# Altium schematic sheet IoT_Greenhouse V1.0 A - Esp32.SchDoc
size A3; DrawnBy: Elio F; Engineer: Elio F; Revision: A; SheetNumber: 3; SheetTotal: 5; Sheet Title: ESP32-C6
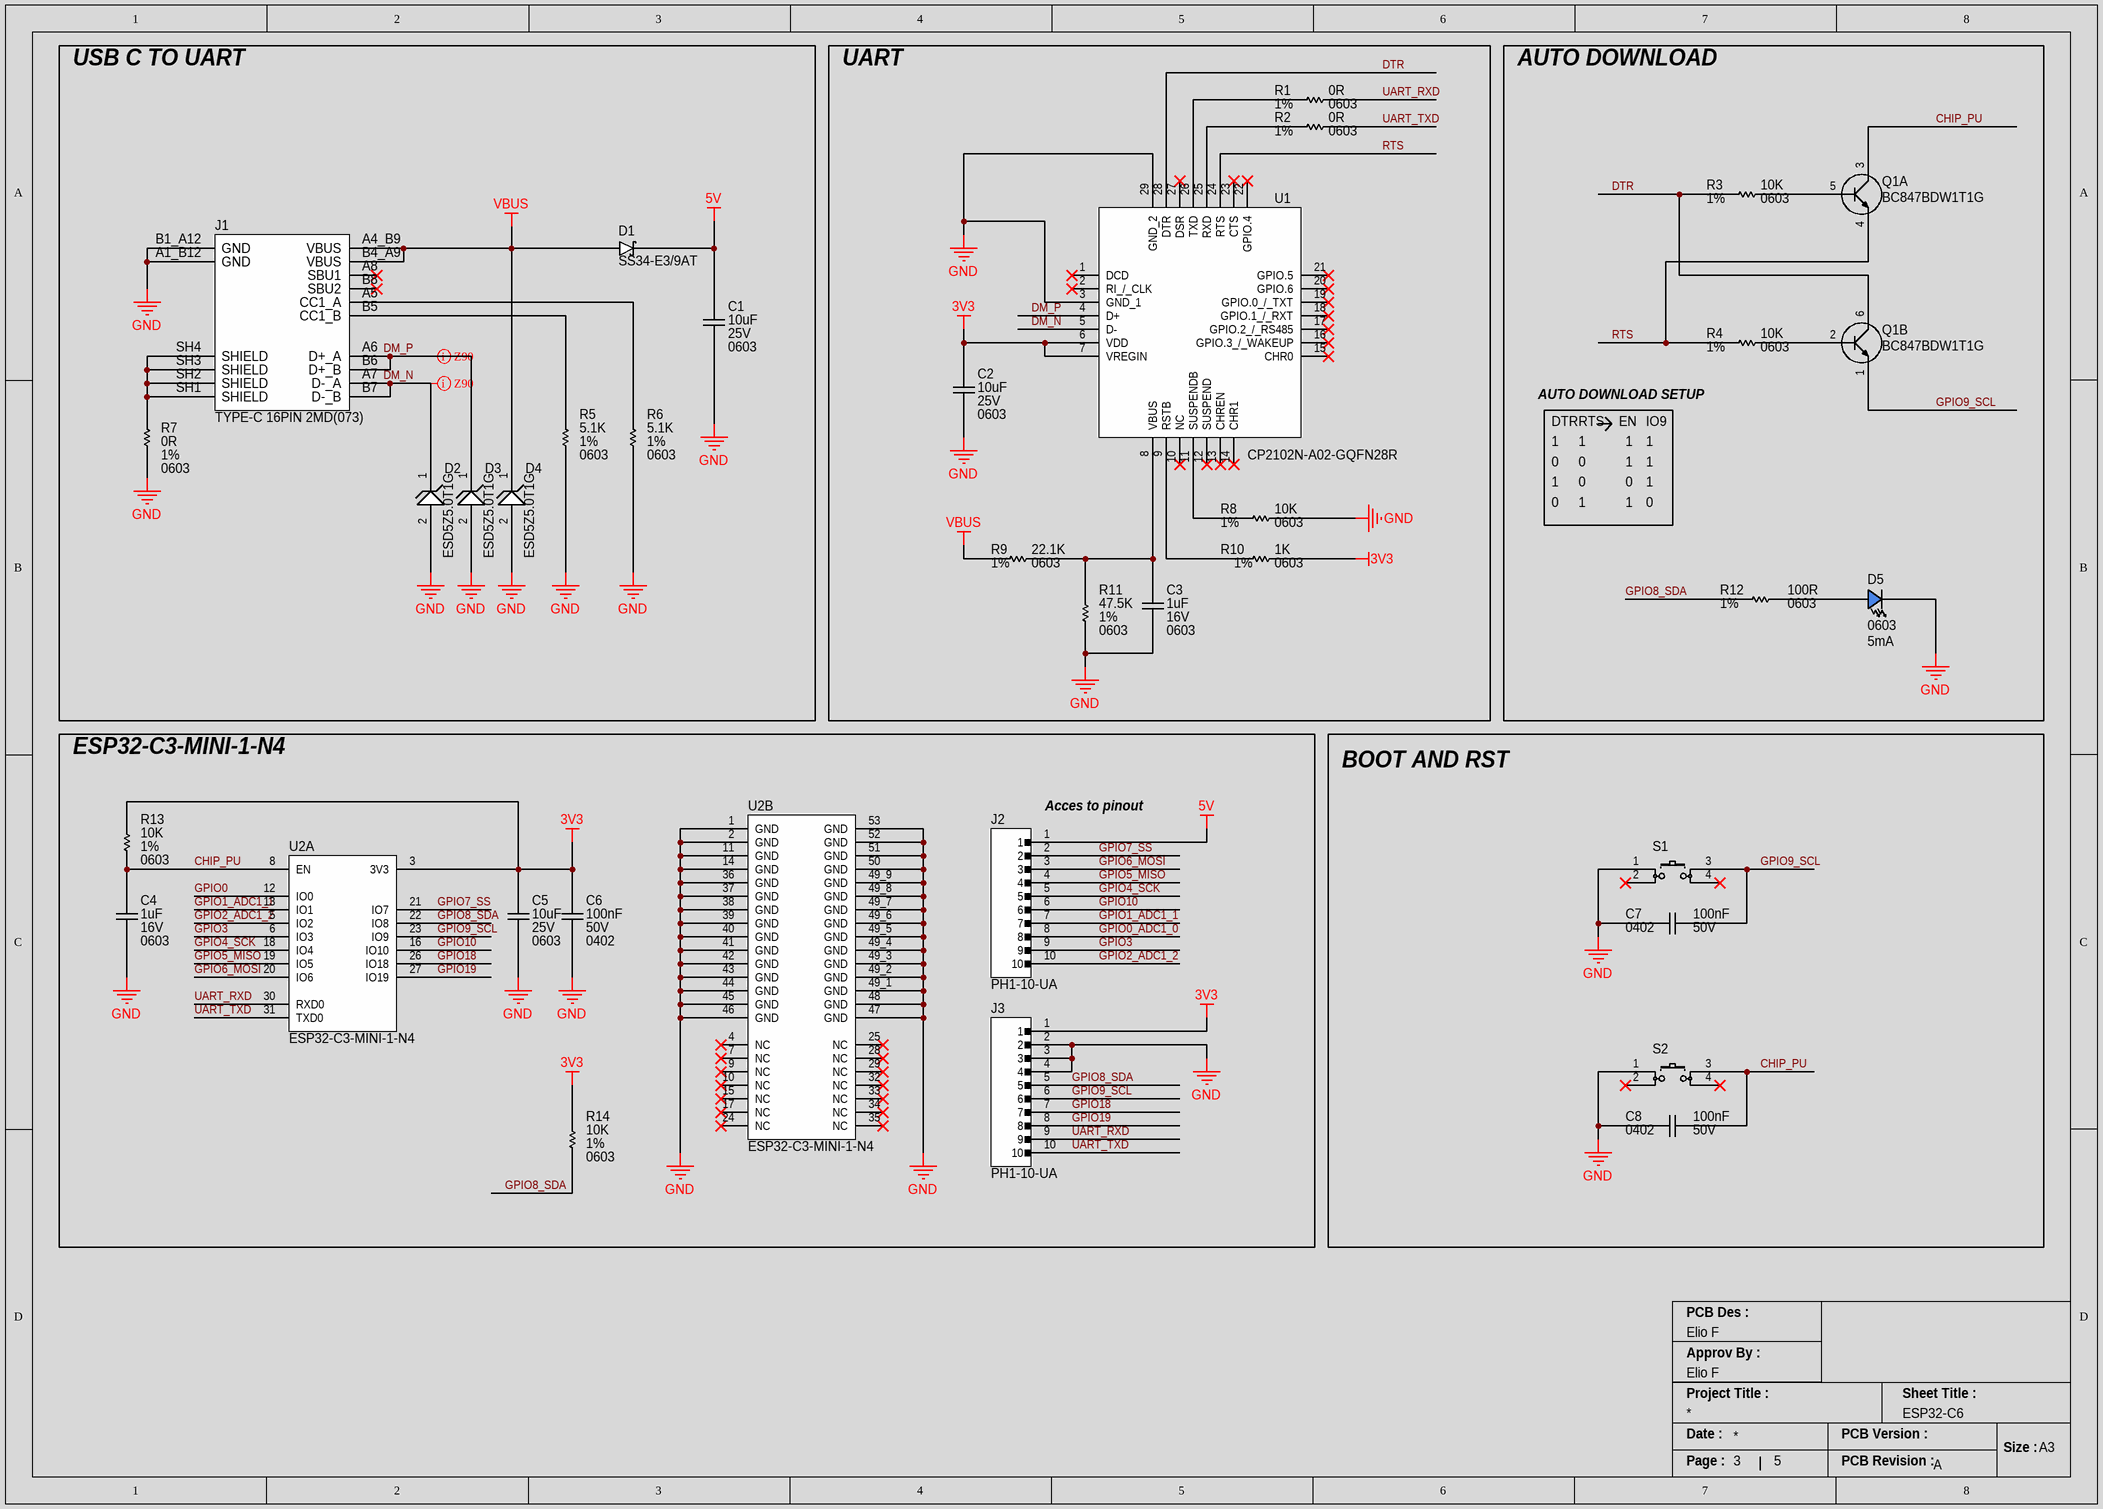
[diagram p0: IoT_Greenhouse V1.0 A - Esp32.SchDoc]

## Parts
C1  Case/Package: 0603  Capacitance: 10uF  Voltage Rating: 25V  [CAP_0603_CAPC1608X08N]  (hidden comment: GRM188R61E106MA73D)
C2  Case/Package: 0603  Capacitance: 10uF  Voltage Rating: 25V  [CAP_0603_CAPC1608X08N]  (hidden comment: GRM188R61E106MA73D)
C3  Voltage Rating: 16V  Capacitance: 1uF  Case/Package: 0603  [CAP_0603_CAPC1608X08N]  (hidden comment: CL10A105KO8NNNC)
C4  Voltage Rating: 16V  Capacitance: 1uF  Case/Package: 0603  [CAP_0603_CAPC1608X08N]  (hidden comment: CL10A105KO8NNNC)
C5  Case/Package: 0603  Capacitance: 10uF  Voltage Rating: 25V  [CAP_0603_CAPC1608X08N]  (hidden comment: GRM188R61E106MA73D)
C6  Voltage Rating: 50V  Capacitance: 100nF  Case/Package: 0402  [CAP_0402_CAPC1005X05N]  (hidden comment: GRM155R71H104KE14D)
C7  Voltage Rating: 50V  Capacitance: 100nF  Case/Package: 0402  [CAP_0402_CAPC1005X05N]  (hidden comment: GRM155R71H104KE14D)
C8  Voltage Rating: 50V  Capacitance: 100nF  Case/Package: 0402  [CAP_0402_CAPC1005X05N]  (hidden comment: GRM155R71H104KE14D)
D1  SS34-E3/9AT  [DIO_Vishay_SMC_MFG]
D2  ESD5Z5.0T1G  [SOD523_SODFL1608X70N]
D3  ESD5Z5.0T1G  [SOD523_SODFL1608X70N]
D4  ESD5Z5.0T1G  [SOD523_SODFL1608X70N]
D5  Case Code (Imperial): 0603  Test Current: 5mA  [LED_0603-BLUE-0.75mm]  (hidden comment: LTST-C193TBKT-5A)
J1  TYPE-C 16PIN 2MD(073)  [CONN_USB_C_16P]
J2  PH1-10-UA  [CONN_HEADER_MALE_10P]
J3  PH1-10-UA  [CONN_HEADER_MALE_10P]
Q1  BC847BDW1T1G  [TRANS_BJT_SOT65P210X110-6N]  (parts A,B of 2)
R1  Tolerance: 1%  Resistance: 0R  Case Code (Imperial): 0603  [RES_0603_RESC1608X04N]  (hidden comment: RC0603FR-070RL)
R2  Tolerance: 1%  Resistance: 0R  Case Code (Imperial): 0603  [RES_0603_RESC1608X04N]  (hidden comment: RC0603FR-070RL)
R3  Resistance: 10K  Tolerance: 1%  Case/Package: 0603  [RES_0603_RESC1608X04N]  (hidden comment: AC0603FR-1010KL)
R4  Resistance: 10K  Tolerance: 1%  Case/Package: 0603  [RES_0603_RESC1608X04N]  (hidden comment: AC0603FR-1010KL)
R5  Tolerance: 1%  Resistance: 5.1K  Case/Package: 0603  [RES_0603_RESC1608X04N]  (hidden comment: RC0603FR-075K1L)
R6  Tolerance: 1%  Resistance: 5.1K  Case/Package: 0603  [RES_0603_RESC1608X04N]  (hidden comment: RC0603FR-075K1L)
R7  Tolerance: 1%  Resistance: 0R  Case Code (Imperial): 0603  [RES_0603_RESC1608X04N]  (hidden comment: RC0603FR-070RL)
R8  Resistance: 10K  Tolerance: 1%  Case/Package: 0603  [RES_0603_RESC1608X04N]  (hidden comment: AC0603FR-1010KL)
R9  Resistance: 22.1K  Tolerance: 1%  Case/Package: 0603  [RES_0603_RESC1608X04N]  (hidden comment: RC0603FR-0722K1L)
R10  Resistance: 1K  Tolerance: 1%  Case/Package: 0603  [RES_0603_RESC1608X04N]  (hidden comment: AC0603FR-101KL)
R11  Tolerance: 1%  Resistance: 47.5K  Case/Package: 0603  [RES_0603_RESC1608X04N]  (hidden comment: AC0603FR-0747K5L)
R12  Case Code (Imperial): 0603  Tolerance: 1%  Resistance: 100R  [CAP_0603_CAPC1608X08N]  (hidden comment: ERJ3EKF1000V)
R13  Resistance: 10K  Tolerance: 1%  Case/Package: 0603  [RES_0603_RESC1608X04N]  (hidden comment: AC0603FR-1010KL)
R14  Resistance: 10K  Tolerance: 1%  Case/Package: 0603  [RES_0603_RESC1608X04N]  (hidden comment: AC0603FR-1010KL)
S1  PTS526SK15SMTR2LFS  [SWT_NO_PTS526SK15SMTR2LFS]  (value not drawn)
S2  PTS526SK15SMTR2LFS  [SWT_NO_PTS526SK15SMTR2LFS]  (value not drawn)
U1  CP2102N-A02-GQFN28R  [IC_BRIDGE_UART_QFN50P500X500X80-29N-D]
U2  ESP32-C3-MINI-1-N4  [XCVR_ESP32-C3-MINI-1-N4]  (parts A,B of 2)

## Blocks framed on the sheet
USB C TO UART: C1 D1-D4 J1 R5-R7
UART: C2 C3 R1 R2 R8-R11 U1
AUTO DOWNLOAD: D5 Q1 R3 R4 R12
ESP32-C3-MINI-1-N4: C4-C6 J2 J3 R13 R14 U2
BOOT AND RST: C7 C8 S1 S2

## Nets
3V3: C2.2 C5.2 C6.2 J3.1 R10.2 R13.1 R14.1 U1.6(VDD) U1.7(VREGIN) U2.3(3V3)
5V: C1.2 D1.1(K) J2.1
GND: C1.1 C2.1 C3.1 C4.1 C5.1 C6.1 C7.2 C8.2 D2.2(A) D3.2(A) D4.2(A) D5.1(C) J1.A1_B12(GND) J1.B1_A12(GND) J3.2 J3.3 J3.4 R5.1 R6.1 R7.1 R8.2 R11.1 S1.1(COM_1) S2.1(COM_1) U1.3(GND_1) U1.29(GND_2) U2.1(GND) U2.2(GND) U2.11(GND) U2.14(GND) U2.36(GND) U2.37(GND) U2.38(GND) U2.39(GND) U2.40(GND) U2.41(GND) U2.42(GND) U2.43(GND) U2.44(GND) U2.45(GND) U2.46(GND) U2.47(GND) U2.48(GND) U2.49_1(GND) U2.49_2(GND) U2.49_3(GND) U2.49_4(GND) U2.49_5(GND) U2.49_6(GND) U2.49_7(GND) U2.49_8(GND) U2.49_9(GND) U2.50(GND) U2.51(GND) U2.52(GND) U2.53(GND)
VBUS: D1.2(A) D4.1(K) J1.A4_B9(VBUS) J1.B4_A9(VBUS) R9.1
CHIP_PU: C4.2 C8.1 Q1.3(COLLECTOR_1) R13.2 S2.3(NO1) U2.8(EN)
DM_N: D2.1(K) J1.A7(D-_A) J1.B7(D-_B) U1.5(D-)
DM_P: D3.1(K) J1.A6(D+_A) J1.B6(D+_B) U1.4(D+)
DTR: Q1.6(COLLECTOR_2) R3.2 U1.28(DTR)
GPIO0: U2.12(IO0)
GPIO0_ADC1_0: J2.8
GPIO1_ADC1_1: J2.7 U2.13(IO1)
GPIO2_ADC1_2: J2.10 U2.5(IO2)
GPIO3: J2.9 U2.6(IO3)
GPIO4_SCK: J2.5 U2.18(IO4)
GPIO5_MISO: J2.4 U2.19(IO5)
GPIO6_MOSI: J2.3 U2.20(IO6)
GPIO7_SS: J2.2 U2.21(IO7)
GPIO8_SDA: J3.5 R12.1 R14.2 U2.22(IO8)
GPIO9_SCL: C7.1 J3.6 Q1.1(EMITTER_2) S1.3(NO1) U2.23(IO9)
GPIO10: J2.6 U2.16(IO10)
GPIO18: J3.7 U2.26(IO18)
GPIO19: J3.8 U2.27(IO19)
RTS: Q1.4(EMITTER_1) R4.2 U1.24(RTS)
UART_RXD: J3.9 R1.1 U2.30(RXD0)
UART_TXD: J3.10 R2.1 U2.31(TXD0)
NetC3_2: C3.2 R9.2 R11.2 U1.8(VBUS)
NetD5_2: D5.2(A) R12.2
NetJ1_A5: J1.A5(CC1_A) R6.2
NetJ1_B5: J1.B5(CC1_B) R5.2
NetJ1_SH1: J1.SH1(SHIELD) J1.SH2(SHIELD) J1.SH3(SHIELD) J1.SH4(SHIELD) R7.2
NetQ1_2: Q1.2(BASE_2) R4.1
NetQ1_5: Q1.5(BASE_1) R3.1
NetR1_2: R1.2 U1.26(TXD)
NetR2_2: R2.2 U1.25(RXD)
NetR8_1: R8.1 U1.11(SUSPENDB)
NetR10_1: R10.1 U1.9(RSTB)

Not connected (* = marked no-connect by the designer): J1 A8(SBU1)* B8(SBU2)*; S1 2(COM2)* 4(NO2)*; S2 2(COM2)* 4(NO2)*; U1 1(DCD)* 2(RI_/_CLK)* 10(NC)* 12(SUSPEND)* 13(CHREN)* 14(CHR1)* 15(CHR0)* 16(GPIO.3_/_WAKEUP)* 17(GPIO.2_/_RS485)* 18(GPIO.1_/_RXT)* 19(GPIO.0_/_TXT)* 20(GPIO.6)* 21(GPIO.5)* 22(GPIO.4)* 23(CTS)* 27(DSR)*; U2 4(NC)* 7(NC)* 9(NC)* 10(NC)* 15(NC)* 17(NC)* 24(NC)* 25(NC)* 28(NC)* 29(NC)* 32(NC)* 33(NC)* 34(NC)* 35(NC)*

## Layout directives
differential pair; differential pair class Z90; net class Z90: DM_N, DM_P

## Notes on the sheet
- AUTO DOWNLOAD SETUP
- DTR
- 1
- RTS
- EN
- IO9
- 0
- (near J2) Acces to pinout
- PCB Des :
- Approv By :
- Project Title :
- Sheet Title :
- Date :
- PCB Version :
- Size :
- A3
- Page :
- PCB Revision :

## Library data of the parts
C1 C2 C5 = CAP_10UF_25V_X5R_0603: Multilayer Ceramic Capacitor, 10 uF, 25 V, ± 20%, X5R, 0603 [1608 Metric]; Manufacturer: Murata; Material: 4241ConductorMaterial; Supplier 1: Digi-Key; Manufacturer Part Number: GRM188R61E106MA73D; RoHS: Yes; Category: Ceramic Capacitors; Stock 1: 2712970; Pricing 1: 1=0.26, 10=0.168, 50=0.1176, 100=0.0949, 500=0.07054, 1000=0.06173 (USD); Mount: Surface Mount; Number of Pins: 2; Case Code (Imperial): 0603; Weight: 0.000222oz; Min Operating Temperature: -55°C; Max Operating Temperature: 85°C; Tolerance: 20%; Packaging: Cut Tape; Package Quantity: 1; Dielectric: X5R; Voltage: 25V; Termination: SMD/SMT; Voltage Rating (DC): 25V; Series: GRM; Construction: Flat; Length: 1.6mm; Width: 0.031inch; Height: 0.8mm; Thickness: 0.031inch; Depth: 0.8mm; Reach SVHC Compliant: No; Lead Free: Lead Free; RoHS Compliant: Yes; ComponentLink1URL: https://datasheet.ciiva.com/22776/c02e-22776427.pdf?src-supplier=Farnell; ComponentLink1Description: https://datasheet.ciiva.com/22776/c02e-22776427.pdf?src-supplier=Farnell; ComponentLink2URL: https://datasheet.ciiva.com/22619/c02e-22619674.pdf?src-supplier=Element14; ComponentLink2Description: https://datasheet.ciiva.com/22619/c02e-22619674.pdf?src-supplier=Element14; ComponentLink3URL: https://datasheet.ciiva.com/22776/608985-22776426.pdf?src-supplier=Farnell; ComponentLink3Description: https://datasheet.ciiva.com/22776/608985-22776426.pdf?src-supplier=Farnell; ComponentLink4URL: https://datasheet.ciiva.com/14906/partnumbering-e-01-14906431.pdf?src-supplier=Digi-Key; ComponentLink4Description: https://datasheet.ciiva.com/14906/partnumbering-e-01-14906431.pdf?src-supplier=Digi-Key; ComponentLink5URL: https://datasheet.ciiva.com/14906/partnumbering-e-01-14906429.pdf?src-supplier=Digi-Key; ComponentLink5Description: https://datasheet.ciiva.com/14906/partnumbering-e-01-14906429.pdf?src-supplier=Digi-Key; Supplier Part Number 1: 490-7202-1-ND; Case Code (Metric): 1608
C3 C4 = CAP_1UF_16V_X5R_0603: CAP CER 1UF 16V X5R 0603; Manufacturer: Samsung; Material: Ceramic; Tolerance: 10%; Manufacturer Part Number: CL10A105KO8NNNC; RoHS: Yes; Category: Ceramic Capacitors; Stock 1: 252255; Pricing 1: 1=0.10000, 10=0.03300, 50=0.01800, 100=0.01470, 500=0.01050, 1000=0.00825 (USD); Mount: Surface Mount; Case Code (Metric): 1608; Case Code (Imperial): 0603; Contact Plating: Tin; Min Operating Temperature: -55°C; Max Operating Temperature: 85°C; Package Quantity: 1; Packaging: Tape and Reel; Dielectric: X5R; Voltage Rating (DC): 16V; Series: CL; Voltage: 16V; Construction: Flat; Length: 1.6mm; Width: 0.031inch; Height: 0.8mm; Thickness: 0.035inch; Depth: 0.8mm; Radiation Hardening: No; Lead Free: Lead Free; RoHS Compliant: Yes; ComponentLink1URL: https://datasheet.ciiva.com/16199/cl10a105ko8nnnc-16199033.pdf?src-supplier=Future+Electronics; ComponentLink1Description: https://datasheet.ciiva.com/16199/cl10a105ko8nnnc-16199033.pdf?src-supplier=Future+Electronics; ComponentLink2URL: https://datasheet.ciiva.com/15195/getdatasheetpartid-359688-15195706.pdf?src-supplier=Verical; ComponentLink2Description: https://datasheet.ciiva.com/15195/getdatasheetpartid-359688-15195706.pdf?src-supplier=Verical; ComponentLink3URL: https://datasheet.ciiva.com/29198/458190-da-01-en-vs-kondensator-0603-29198480.pdf?src-supplier=Conrad; ComponentLink3Description: https://datasheet.ciiva.com/29198/458190-da-01-en-vs-kondensator-0603-29198480.pdf?src-supplier=Conrad; Supplier 1: Digi-Key; Supplier 2: Mouser; Supplier 3: Newark; Supplier Part Number 1: 1276-1034-1-ND; Supplier Part Number 2: 187-CL10A105KO8NNNC; Supplier Part Number 3: 82AC9279
C6-C8 = CAP_100NF_50V_X7R_0402: Multilayer Ceramic Capacitor, 0.1 uF, 16 V, ± 10%, X7R, 0402 [1005 Metric]; Manufacturer: Murata; Dissipation Factor: 0.025%; Temperature Coefficient: 30ppm/°C; Supplier 1: DigiKey; Manufacturer Part Number: GRM155R71H104KE14D; RoHS: Yes; Category: Ceramic Capacitors; Stock 1: 13730790; Pricing 1: 1=0.1, 10=0.023, 50=0.0132, 100=0.0102, 500=0.00768, 1000=0.00603, 2500=0.00548, 5000=0.00504 (USD); Mount: Surface Mount; Number of Pins: 2NUMBER; Case Code (Metric): 1005; Material: Ceramic; Case Code (Imperial): 0402; Weight: 0.000212oz; Dielectric Material: Ceramic; Min Operating Temperature: -55°C; Max Operating Temperature: 125°C; Packaging: Tape and Reel; Package Quantity: 10000; Series: GRM; Tolerance: 10%; Dielectric: X7R; Termination: SMD/SMT; Voltage: 50V; Voltage Rating (DC): 50V; Construction: Flat; Length: 1mm; Width: 0.5mm; Height: 0.5mm; Depth: 0.5mm; Thickness: 0.022inch; Reach SVHC Compliant: No; RoHS Compliant: Yes; Lead Free: 5697LeadFree; ComponentLink1URL: http://www.farnell.com/datasheets/2079156.pdf?src-supplier=Farnell; ComponentLink1Description: http://www.farnell.com/datasheets/2079156.pdf?src-supplier=Farnell; ComponentLink2URL: http://www.mouser.com/ds/2/281/c02e-2905.pdf?src-supplier=Mouser; ComponentLink2Description: http://www.mouser.com/ds/2/281/c02e-2905.pdf?src-supplier=Mouser; ComponentLink3URL: http://www.farnell.com/datasheets/2079156.pdf?src-supplier=Newark; ComponentLink3Description: http://www.farnell.com/datasheets/2079156.pdf?src-supplier=Newark; ComponentLink4URL: https://datasheet.octopart.com/GRM155R71H104KE14D-Murata-datasheet-22122223.pdf?src-supplier=Future+Electronics; ComponentLink4Description: https://datasheet.octopart.com/GRM155R71H104KE14D-Murata-datasheet-22122223.pdf?src-supplier=Future+Electronics; ComponentLink5URL: https://search.murata.co.jp/Ceramy/image/img/A01X/G101/ENG/GRM155R71H104KE14-01.pdf?src-supplier=Digi-Key; ComponentLink5Description: https://search.murata.co.jp/Ceramy/image/img/A01X/G101/ENG/GRM155R71H104KE14-01.pdf?src-supplier=Digi-Key; ComponentLink6URL: http://psearch.en.murata.com/capacitor/product/GRM155R71H104KE14%23.pdf?src-supplier=Avnet; ComponentLink6Description: http://psearch.en.murata.com/capacitor/product/GRM155R71H104KE14%23.pdf?src-supplier=Avnet; ComponentLink7URL: https://datasheet.octopart.com/GRM155R71H104KE14D-Murata-datasheet-66077078.pdf?src-supplier=Element14; ComponentLink7Description: https://datasheet.octopart.com/GRM155R71H104KE14D-Murata-datasheet-66077078.pdf?src-supplier=Element14; Supplier Part Number 1: 490-10700-6-ND; Supplier 2: Digikey; Stock 2: 3706055; Pricing 2: 1=0.1, 10=0.037, 50=0.021, 100=0.0162, 500=0.01224, 1000=0.00961, 2500=0.00874, 5000=0.00804 (USD); Halogen Free: 5694HalogenFree; ComponentLink8URL: http://www.mouser.com/ds/2/447/UPY-GPHC_X5R_4V-to-50V_25-1131599.pdf?src-supplier=Mouser; ComponentLink8Description: http://www.mouser.com/ds/2/447/UPY-GPHC_X5R_4V-to-50V_25-1131599.pdf?src-supplier=Mouser; ComponentLink9URL: https://datasheet.octopart.com/CC0402KRX5R8BB104-Yageo-datasheet-137700082.pdf?src-supplier=Future+Electronics; ComponentLink9Description: https://datasheet.octopart.com/CC0402KRX5R8BB104-Yageo-datasheet-137700082.pdf?src-supplier=Future+Electronics; ComponentLink10URL: http://www.yageo.com/documents/recent/UPY-GPHC_X5R_4V-to-50V_25.pdf?src-supplier=Digikey; ComponentLink10Description: http://www.yageo.com/documents/recent/UPY-GPHC_X5R_4V-to-50V_25.pdf?src-supplier=Digikey; ComponentLink11URL: https://datasheet.octopart.com/CC0402KRX5R8BB104-Yageo-datasheet-140260304.pdf?src-supplier=Newark; ComponentLink11Description: https://datasheet.octopart.com/CC0402KRX5R8BB104-Yageo-datasheet-140260304.pdf?src-supplier=Newark; ComponentLink12URL: https://datasheet.octopart.com/CC0402KRX5R8BB104-Yageo-datasheet-170350636.pdf?src-supplier=Future+Electronics; ComponentLink12Description: https://datasheet.octopart.com/CC0402KRX5R8BB104-Yageo-datasheet-170350636.pdf?src-supplier=Future+Electronics; ComponentLink13URL: http://www.yageo.com/documents/recent/UPY-GPHC_X5R_4V-to-50V-16.pdf?src-supplier=Future+Electronics; ComponentLink13Description: http://www.yageo.com/documents/recent/UPY-GPHC_X5R_4V-to-50V-16.pdf?src-supplier=Future+Electronics; Supplier Part Number 2: 311-1697-1-ND
D1 = DIO_SCTKY_40V_3A: Rectifier Diode, schottky, 40V V(Rrm), do-214Ab / Smc; Manufacturer: Vishay Semiconductors; Max Surge Current: 100A; Element Configuration: Single; Max Reverse Leakage Current: 500uA; Average Rectified Current: 3A; Forward Voltage: 500mV; Supplier 1: TTI; Manufacturer Part Number: SS34-E3/9AT; RoHS: Yes; Category: Rectifier Diodes; Stock 1: 7000; Pricing 1: 3500=0.18200 (USD); Mount: Surface Mount; Case/Package: SMC; Number of Pins: 2; Min Operating Temperature: -55°C; Max Operating Temperature: 125°C; Package Quantity: 3500; Packaging: Tape and Reel; Peak Non-Repetitive Surge Current: 100A; Max Reverse Voltage (DC): 40V; Series: -; Radiation Hardening: No; RoHS Compliant: Yes; ComponentLink1URL: https://datasheet.ciiva.com/920/ss32-920172.pdf?src-supplier=Digi-Key; ComponentLink1Description: https://datasheet.ciiva.com/920/ss32-920172.pdf?src-supplier=Digi-Key; Supplier Part Number 1: SS34-E3/9AT; Max Reverse Current: 500uA; Max Repetitive Reverse Voltage (Vrrm): 40V; Forward Current: 3A
D2-D4 = DIO_TVS_5V_ESD5Z5.0T1G: ESD5Z Series 6.2 V 80 pF 5 Vrwm TVS and ESD Protection Diodes - SOD-523; Manufacturer: ON Semiconductor; Direction: Unidirectional; Operating Supply Voltage: 5V; Min Breakdown Voltage: 6.2V; Peak Pulse Power: 174W; Peak Pulse Current: 9.4A; Test Current: 1mA; Max Reverse Leakage Current: 50nA; Number of Elements: 1; Capacitance: 80pF; Clamping Voltage: 18.6V; Power Line Protection: No; ESD Protection: Yes; Max Power Dissipation: 240W; Diode Type: ZENER; Clamping Voltage-Max: 11.6V; Supplier 1: Digikey; Manufacturer Part Number: ESD5Z5.0T1G; RoHS: Yes; Category: ESD and Circuit Protection ICs; Stock 1: 292695; Pricing 1: 1=0.24, 10=0.162, 100=0.0791, 500=0.06598, 1000=0.04584, 3000=0.03973, 6000=0.03686, 9000=0.03056, 30000=0.03002, 75000=0.02697, 150000=0.02337 (USD); Case/Package: SOD-523-2; Number of Pins: 2; Min Operating Temperature: -55°C; Max Operating Temperature: 150°C; Packaging: Tape and Reel; Reverse Standoff Voltage: 5V; Breakdown Voltage: 6.2V; Working Voltage: 5V; Package Quantity: 1; Max Surge Current: 9.4A; Number of Channels: 1; Reverse Breakdown Voltage: 6.2V; Number of Unidirectional Channels: 1; Polarity: Unidirectional; Termination: SMD/SMT; Max Breakdown Voltage: 6.2V; Leakage Current: 50nA; Number of Lines: 1; Series: Automotive, AEC-Q101; Length: 1.2mm; Width: 0.9mm; Height: 0.7mm; Depth: 0.8mm; Radiation Hardening: No; Lead Free: Lead Free; Halogen Free: Halogen Free; RoHS Compliant: Yes; Reach SVHC Compliant: No; ComponentLink1URL: https://datasheet.ciiva.com/15143/getdatasheetpartid-147990-15143766.pdf?src-supplier=Verical; ComponentLink1Description: https://datasheet.ciiva.com/15143/getdatasheetpartid-147990-15143766.pdf?src-supplier=Verical; ComponentLink2URL: https://datasheet.ciiva.com/30479/0900766b8125092b-30479039.pdf?src-supplier=Rs; ComponentLink2Description: https://datasheet.ciiva.com/30479/0900766b8125092b-30479039.pdf?src-supplier=Rs; ComponentLink3URL: https://datasheet.ciiva.com/22637/esd5z2-5t1-d-22637184.pdf?src-supplier=Element14; ComponentLink3Description: https://datasheet.ciiva.com/22637/esd5z2-5t1-d-22637184.pdf?src-supplier=Element14; ComponentLink4URL: https://datasheet.ciiva.com/27748/1311839-27748800.pdf?src-supplier=Jameco; ComponentLink4Description: https://datasheet.ciiva.com/27748/1311839-27748800.pdf?src-supplier=Jameco; ComponentLink5URL: https://datasheet.ciiva.com/339/esd5z2-5t1-d-339748.pdf?src-supplier=Digikey; ComponentLink5Description: https://datasheet.ciiva.com/339/esd5z2-5t1-d-339748.pdf?src-supplier=Digikey; ComponentLink6URL: https://datasheet.ciiva.com/339/esd5z2-5t1-d-339749.pdf?src-supplier=Digikey; ComponentLink6Description: https://datasheet.ciiva.com/339/esd5z2-5t1-d-339749.pdf?src-supplier=Digikey; ComponentLink7URL: https://datasheet.ciiva.com/339/esd5z2-5t1-d-339750.pdf?src-supplier=Digikey; ComponentLink7Description: https://datasheet.ciiva.com/339/esd5z2-5t1-d-339750.pdf?src-supplier=Digikey; ComponentLink8URL: https://datasheet.ciiva.com/16385/esd5z2-5t1-d-16385093.pdf?src-supplier=Future+Electronics; ComponentLink8Description: https://datasheet.ciiva.com/16385/esd5z2-5t1-d-16385093.pdf?src-supplier=Future+Electronics; ComponentLink9URL: https://datasheet.ciiva.com/8084/esd5z2-5t1-d-8084057.pdf?src-supplier=Avnet; ComponentLink9Description: https://datasheet.ciiva.com/8084/esd5z2-5t1-d-8084057.pdf?src-supplier=Avnet; ComponentLink10URL: https://datasheet.ciiva.com/22637/1878252-22637182.pdf?src-supplier=Element14; ComponentLink10Description: https://datasheet.ciiva.com/22637/1878252-22637182.pdf?src-supplier=Element14; Supplier Part Number 1: ESD5Z5.0T1GOSCT-ND
D5 = LED_DIO_BLUE_5mA_0603: LED Uni-Color Blue 468nm 2-Pin Chip LED T/R; Manufacturer: Vishay Lite-On; Lens Color: Colorless; Luminous Intensity: 15mcd; Viewing Angle: 130°; Lens Style: Diffused,Colorless,Rectangular,Clear; Dominant Wavelength: 475nm; Lens Transparency: Clear; Number of Elements: 1; Power Dissipation: 76mW; Reverse Voltage: 5V; Forward Current: 20mA; Forward Voltage: 2.8V; Manufacturer Part Number: LTST-C193TBKT-5A; RoHS: Yes; Category: LEDs; Stock 1: 924158; Pricing 1: 1=0.30000, 10=0.23400, 100=0.10510, 500=0.09492, 1000=0.07797, 2000=0.06780 (USD); Mount: Surface Mount; Case/Package: 0603; Number of Pins: 2; Color: Blue; Case Code (Metric): 1608; Min Operating Temperature: -20°C; Max Operating Temperature: 80°C; Packaging: Tape and Reel; Package Quantity: 1; Number of LEDs: 1; Length: 1.6mm; Width: 0.8mm; Height: 0.35mm; Depth: 0.8mm; Radiation Hardening: No; RoHS Compliant: Yes; Lead Free: Lead Free; ComponentLink1URL: https://datasheet.ciiva.com/2111/ltst-c193tbkt-5a-2111219.pdf?src-supplier=Digi-Key; ComponentLink1Description: https://datasheet.ciiva.com/2111/ltst-c193tbkt-5a-2111219.pdf?src-supplier=Digi-Key; ComponentLink2URL: https://datasheet.ciiva.com/4688/lite-on-ltst-c193tbkt-5a-187386-4688832.pdf?src-supplier=Mouser; ComponentLink2Description: https://datasheet.ciiva.com/4688/lite-on-ltst-c193tbkt-5a-187386-4688832.pdf?src-supplier=Mouser; ComponentLink3URL: https://datasheet.ciiva.com/16210/ltst-c193tbkt-5a-16210824.pdf?src-supplier=Future+Electronics; ComponentLink3Description: https://datasheet.ciiva.com/16210/ltst-c193tbkt-5a-16210824.pdf?src-supplier=Future+Electronics; ComponentLink4URL: https://datasheet.ciiva.com/15201/getdatasheetpartid-293056-15201395.pdf?src-supplier=Verical; ComponentLink4Description: https://datasheet.ciiva.com/15201/getdatasheetpartid-293056-15201395.pdf?src-supplier=Verical; ComponentLink5URL: https://datasheet.ciiva.com/11773/0900766b80dc0554-11773880.pdf?src-supplier=Rs; ComponentLink5Description: https://datasheet.ciiva.com/11773/0900766b80dc0554-11773880.pdf?src-supplier=Rs; ComponentLink6URL: https://datasheet.ciiva.com/2111/p-100-ltst-c193tbkt-5a-2111220.pdf?src-supplier=Digi-Key; ComponentLink6Description: https://datasheet.ciiva.com/2111/p-100-ltst-c193tbkt-5a-2111220.pdf?src-supplier=Digi-Key; ComponentLink7URL: https://datasheet.ciiva.com/2111/p-100-ltst-c193tbkt-5a-2111221.pdf?src-supplier=Digi-Key; ComponentLink7Description: https://datasheet.ciiva.com/2111/p-100-ltst-c193tbkt-5a-2111221.pdf?src-supplier=Digi-Key; Supplier 1: Digi-Key; Supplier 2: Arrow Electronics; Supplier 3: Future Electronics; Supplier Part Number 1: 160-1827-1-ND; Supplier Part Number 2: LTST-C193TBKT-5A; Supplier Part Number 3: 1101072; Illumination Color: Blue
J1 = CONN_USB_TYPEC_2.0_16P_TYPE-C 16PIN 2MD(073): 5A 1 Surface Mount 16P Female -25℃~+85℃ Type-C SMD USB Connectors ROHS; Manufacturer: SHOU HAN; Supplier 1: LCSC; Manufacturer Part Number: TYPE-C 16PIN 2MD(073); RoHS: No; Category: Connectors; Pricing 1: 0.0523 (USD); Supplier Part Number 1: 664-12402012E212ACT-ND
J2 J3 = CONN_HEADER_MALE_10P_2.54mm_PH1-10-UA: Conn Unshrouded Header HDR 12 POS 2.54mm Solder RA Side Entry Thru-Hole Bag; Manufacturer: Adam Equipment; Number of Positions: 10; Voltage Rating (AC): 250V; Supplier 1: Digikey; Manufacturer Part Number: PH1-10-UA; RoHS: Yes; Category: Connectors; Stock 1: 3363; Pricing 1: 1=0.19, 10=0.144, 100=0.1095, 500=0.09102, 1000=0.08424, 5000=0.07078, 10000=0.06586 (USD); Contact Material: Brass; Contact Shape: Square; Contact Finish - Mating: GOLD; Insulation Material: PBT; Insulation Color: Black; Min Operating Temperature: -40°C; Max Operating Temperature: 105°C; Number of Rows: 1; Termination: Solder; Series: PH1; Connector Type: Header; Fastening Type: Pull; Packaging: Bulk; Contact Type: Male Pin; Pitch: 2.54mm; Flammability Rating: UL94 V-0; ComponentLink1URL: https://datasheet.ciiva.com/13676/page-292-295-13676646.pdf?src-supplier=Mouser; ComponentLink1Description: https://datasheet.ciiva.com/13676/page-292-295-13676646.pdf?src-supplier=Mouser; Supplier Part Number 1: 2057-PH1-10-UA-ND
Q1 = TRANS_BIPOLAR_NPN_BC847BDW1T1G: ON Semi BC847BDW1T1G Dual NPN Bipolar Transistor; 0.1 A; 45 V; 6-Pin SC-88; Manufacturer: ON Semiconductor; Max Power Dissipation: 380mW; Max Collector Current: 100mA; Collector Base Voltage (VCBO): 50V; Transition Frequency: 100MHz; Collector Emitter Breakdown Voltage: 45V; Collector-emitter Voltage-Max: 600mV; hFE Min: 200; Emitter Base Voltage (VEBO): 6V; Number of Elements: 2; Supplier 1: Digikey; Manufacturer Part Number: BC847BDW1T1G; RoHS: Yes; Category: BJTs; Stock 1: 35041; Pricing 1: 1=0.22, 10=0.149, 100=0.0729, 500=0.06078, 1000=0.04224 (USD); Case/Package: SOT-363-6; Number of Pins: 6; Contact Plating: Tin,Matte; Min Operating Temperature: -55°C; Max Operating Temperature: 150°C; Package Quantity: 3000; Packaging: Tape and Reel; Max Breakdown Voltage: 45V; Polarity: NPN; Series: -; Collector Emitter Voltage (VCEO): 45V; Collector Emitter Saturation Voltage: 600mV; Power Dissipation: 380mW; Max Frequency: 100MHz; Gain Bandwidth Product: 100MHz; Frequency: 100MHz; Voltage Rating (DC): 45V; Current Rating: 100mA; Length: 2mm; Width: 1.25mm; Height: 0.9mm; Radiation Hardening: No; RoHS Compliant: Yes; Lead Free: Lead Free; Halogen Free: Halogen Free; Reach SVHC Compliant: No; ComponentLink1URL: https://datasheet.ciiva.com/15138/getdatasheetpartid-32925-15138586.pdf?src-supplier=Verical; ComponentLink1Description: https://datasheet.ciiva.com/15138/getdatasheetpartid-32925-15138586.pdf?src-supplier=Verical; ComponentLink2URL: https://datasheet.ciiva.com/34303/2012187-34303831.pdf?src-supplier=Jameco; ComponentLink2Description: https://datasheet.ciiva.com/34303/2012187-34303831.pdf?src-supplier=Jameco; ComponentLink3URL: https://datasheet.ciiva.com/968/bc846bdw1t1-d-968805.pdf?src-supplier=Digikey; ComponentLink3Description: https://datasheet.ciiva.com/968/bc846bdw1t1-d-968805.pdf?src-supplier=Digikey; ComponentLink4URL: https://datasheet.ciiva.com/968/bc846bdw1t1-d-968806.pdf?src-supplier=Digikey; ComponentLink4Description: https://datasheet.ciiva.com/968/bc846bdw1t1-d-968806.pdf?src-supplier=Digikey; ComponentLink5URL: https://datasheet.ciiva.com/968/bc846bdw1t1-d-968807.pdf?src-supplier=Digikey; ComponentLink5Description: https://datasheet.ciiva.com/968/bc846bdw1t1-d-968807.pdf?src-supplier=Digikey; ComponentLink6URL: https://datasheet.ciiva.com/1215/bc846bdw1t1-d-1215105.pdf?src-supplier=Farnell; ComponentLink6Description: https://datasheet.ciiva.com/1215/bc846bdw1t1-d-1215105.pdf?src-supplier=Farnell; ComponentLink7URL: https://datasheet.ciiva.com/22653/1708249-22653900.pdf?src-supplier=Element14; ComponentLink7Description: https://datasheet.ciiva.com/22653/1708249-22653900.pdf?src-supplier=Element14; ComponentLink8URL: https://datasheet.ciiva.com/16201/bc846bdw1t1-d-16201675.pdf?src-supplier=Future+Electronics; ComponentLink8Description: https://datasheet.ciiva.com/16201/bc846bdw1t1-d-16201675.pdf?src-supplier=Future+Electronics; Supplier Part Number 1: BC847BDW1T1GOSCT-ND
R1 R2 R7 = RES_0R_1%_100mW_0603: RC Series 0603 0.1 W 0 Ohm Jumper Surface Mount Thick Film Chip Resistor; Manufacturer: Yageo; Power Rating: 100mW; Voltage Rating (DC): 50V; Temperature Coefficient: 200ppm/°C; Current Rating: 1A; Working Voltage: 75V; Supplier 1: Digi-Key; Manufacturer Part Number: RC0603FR-070RL; RoHS: Yes; Category: Chip SMD Resistors; Stock 1: 2843917; Pricing 1: 1=0.10000, 10=0.01800, 25=0.01320, 50=0.01000, 100=0.00730, 250=0.00560, 500=0.00448, 1000=0.00329 (USD); Case/Package: 0603; Number of Pins: 2; Contact Plating: Tin,Matte; Case Code (Metric): 1608; Min Operating Temperature: -55°C; Max Operating Temperature: 155°C; Packaging: Tape and Reel; Resistor Type: Thick Film; Package Quantity: 5000; Voltage Rating: 50V; Number of Terminations: 2; Termination: SMD/SMT; Max Power Dissipation: 100mW; Features: Moisture Resistant; Series: RC; Construction: Rectangular; Resistance Tolerance: 1%; Technology: THICK FILM; Length: 1.6mm; Width: 0.8mm; Height: 0.45mm; Depth: 0.8mm; Radiation Hardening: No; Reach SVHC Compliant: Yes; Lead Free: Lead Free; RoHS Compliant: Yes; Military Standard: Not; ComponentLink1URL: https://datasheet.ciiva.com/11808/0900766b80f96399-11808172.pdf?src-supplier=Rs; ComponentLink1Description: https://datasheet.ciiva.com/11808/0900766b80f96399-11808172.pdf?src-supplier=Rs; ComponentLink2URL: https://datasheet.ciiva.com/5684/443971-5684699.pdf?src-supplier=Farnell; ComponentLink2Description: https://datasheet.ciiva.com/5684/443971-5684699.pdf?src-supplier=Farnell; ComponentLink3URL: https://datasheet.ciiva.com/7983/443971-7983627.pdf?src-supplier=Element14; ComponentLink3Description: https://datasheet.ciiva.com/7983/443971-7983627.pdf?src-supplier=Element14; ComponentLink4URL: https://datasheet.ciiva.com/22643/1868787-22643388.pdf?src-supplier=Element14; ComponentLink4Description: https://datasheet.ciiva.com/22643/1868787-22643388.pdf?src-supplier=Element14; ComponentLink5URL: https://datasheet.ciiva.com/46382/443971-46382072.pdf?src-supplier=Element14; ComponentLink5Description: https://datasheet.ciiva.com/46382/443971-46382072.pdf?src-supplier=Element14; ComponentLink6URL: https://datasheet.ciiva.com/29721/pyu-r-int-thick-7-29721178.pdf?src-supplier=Digi-Key; ComponentLink6Description: https://datasheet.ciiva.com/29721/pyu-r-int-thick-7-29721178.pdf?src-supplier=Digi-Key; ComponentLink7URL: https://datasheet.ciiva.com/29721/pyu-rc0603-51-rohs-l-4-29721179.pdf?src-supplier=Digi-Key; ComponentLink7Description: https://datasheet.ciiva.com/29721/pyu-rc0603-51-rohs-l-4-29721179.pdf?src-supplier=Digi-Key; ComponentLink8URL: https://datasheet.ciiva.com/5558/rc0603-272842-5558341.pdf?src-supplier=Mouser; ComponentLink8Description: https://datasheet.ciiva.com/5558/rc0603-272842-5558341.pdf?src-supplier=Mouser; Supplier Part Number 1: 311-0.0HRCT-ND
R3 R4 R8 R13 R14 = RES_10K_1%_100mW_0603: Chip Resistor Automotive Grade Thick Film 0603 10kOhm 1% Paper T/R; Manufacturer: Yageo; Voltage Rating: 50V; Power Rating: 100mW; Temperature Coefficient: 100ppm/°C; Manufacturer Part Number: AC0603FR-1010KL; RoHS: Yes; Category: Chip SMD Resistors; Stock 1: 172891; Pricing 1: 1=0.10000, 10=0.02500, 100=0.01030, 1000=0.00463, 2500=0.00402, 5000=0.00332 (USD); Case Code (Imperial): 0603; Case Code (Metric): 1608; Weight: 7.1E-05oz; Min Operating Temperature: -55°C; Max Operating Temperature: 155°C; Packaging: Tape and Reel; Termination: SMD/SMT; Series: AC; Length: 1.6mm; Width: 0.8mm; Height: 0.45mm; RoHS Compliant: Yes; ComponentLink1URL: http://www.mouser.com/ds/2/447/yageodocoutput-1111992.pdf?src-supplier=Mouser; ComponentLink1Description: http://www.mouser.com/ds/2/447/yageodocoutput-1111992.pdf?src-supplier=Mouser; Supplier 1: Digi-Key; Supplier 2: Newark; Supplier 3: Avnet; Supplier Part Number 1: 13-AC0603FR-1010KLCT-ND; Supplier Part Number 2: 49AK0662; Supplier Part Number 3: 49AK0662
R5 R6 = RES_5.1K_1%_100mW_0603: SMD Chip Resistor, 5.1 kOhm, ± 1%, 100 mW, 0603 [1608 Metric], Thick Film, General Purpose; Manufacturer: Yageo; Power Rating: 100mW; Temperature Coefficient: 100ppm/°C; Voltage Rating (DC): 50V; Supplier 1: Digi-Key; Manufacturer Part Number: RC0603FR-075K1L; RoHS: Yes; Category: Chip SMD Resistors; Stock 1: 3197702; Pricing 1: 1=0.1, 10=0.018, 50=0.0106, 100=0.0088, 500=0.00592, 1000=0.00505 (USD); Number of Pins: 2; Case Code (Imperial): 0603; Case Code (Metric): 1608; Size Code: 0603; Min Operating Temperature: -55°C; Max Operating Temperature: 155°C; Series: RC; Packaging: Tape and Reel; Package Quantity: 1; Termination: SMD/SMT; Resistor Type: Thick Film; Number of Terminations: 2; Max Power Dissipation: 100mW; Features: Moisture Resistant; Resistance Tolerance: 1%; Construction: Rectangular; Length: 0.063inch; Width: 0.031inch; Height: 0.022inch; Depth: 0.8mm; RoHS Compliant: Yes; Reach SVHC Compliant: No; Military Standard: Not; Lead Free: Lead Free; ComponentLink1URL: https://datasheet.ciiva.com/15189/getdatasheetpartid-326732-15189786.pdf?src-supplier=Verical; ComponentLink1Description: https://datasheet.ciiva.com/15189/getdatasheetpartid-326732-15189786.pdf?src-supplier=Verical; ComponentLink2URL: https://datasheet.ciiva.com/46395/443971-46395016.pdf?src-supplier=Element14; ComponentLink2Description: https://datasheet.ciiva.com/46395/443971-46395016.pdf?src-supplier=Element14; ComponentLink3URL: https://datasheet.ciiva.com/2454/pyu-r-int-thick-7-2454045.pdf?src-supplier=Digi-Key; ComponentLink3Description: https://datasheet.ciiva.com/2454/pyu-r-int-thick-7-2454045.pdf?src-supplier=Digi-Key; ComponentLink4URL: https://datasheet.ciiva.com/2454/pyu-r-int-thick-7-2454046.pdf?src-supplier=Digi-Key; ComponentLink4Description: https://datasheet.ciiva.com/2454/pyu-r-int-thick-7-2454046.pdf?src-supplier=Digi-Key; ComponentLink5URL: https://datasheet.ciiva.com/2454/pyu-r-int-thick-7-2454047.pdf?src-supplier=Digi-Key; ComponentLink5Description: https://datasheet.ciiva.com/2454/pyu-r-int-thick-7-2454047.pdf?src-supplier=Digi-Key; Supplier Part Number 1: 311-5.10KHRCT-ND; Voltage Rating: 50V
R9 = RES_22.1K_1%_100mW_0603: SMD Chip Resistor, 22.1 kOhm, ± 1%, 100 mW, 0603 [1608 Metric], Thick Film, General Purpose; Manufacturer: Yageo; Power Rating: 100mW; Voltage Rating: 50V; Temperature Coefficient: 100ppm/°C; Supplier 1: Digikey; Manufacturer Part Number: RC0603FR-0722K1L; RoHS: Yes; Category: Chip SMD Resistors; Stock 1: 270995; Pricing 1: 1=0.1, 10=0.019, 50=0.0112, 100=0.0093, 500=0.00622, 1000=0.00532 (USD); Case Code (Imperial): 0603; Case Code (Metric): 1608; Size Code: 0603; Min Operating Temperature: -55°C; Max Operating Temperature: 155°C; Package Quantity: 5000; Packaging: Tape and Reel; Termination: SMD/SMT; Series: RC; Features: Moisture Resistant; Max Power Dissipation: 100mW; Number of Terminations: 2; Voltage Rating (DC): 50V; Length: 1.6mm; Width: 0.8mm; Height: 0.45mm; RoHS Compliant: Yes; Lead Free: 5697LeadFree; ComponentLink1URL: https://datasheet.ciiva.com/12555/rc0603-272842-12555287.pdf?src-supplier=Mouser; ComponentLink1Description: https://datasheet.ciiva.com/12555/rc0603-272842-12555287.pdf?src-supplier=Mouser; Supplier Part Number 1: 311-22.1KHRCT-ND
R10 = RES_1K_1%_100mW_0603: Chip Resistor Automotive Grade Thick Film 0603 1kOhm 1% Paper T/R; Manufacturer: Yageo; Voltage Rating: 50V; Temperature Coefficient: 100ppm/°C; Power Rating: 100mW; Manufacturer Part Number: AC0603FR-101KL; RoHS: Yes; Category: Chip SMD Resistors; Stock 1: 108593; Pricing 1: 1=0.10000, 10=0.02500, 100=0.01030, 1000=0.00463, 2500=0.00402, 5000=0.00332 (USD); Case Code (Imperial): 0603; Case Code (Metric): 1608; Min Operating Temperature: -55°C; Max Operating Temperature: 155°C; Packaging: Tape and Reel; Termination: SMD/SMT; Series: AC; Length: 1.6mm; Width: 0.8mm; Height: 0.45mm; RoHS Compliant: Yes; ComponentLink1URL: http://www.mouser.com/ds/2/447/yageodocoutput-1111992.pdf?src-supplier=Mouser; ComponentLink1Description: http://www.mouser.com/ds/2/447/yageodocoutput-1111992.pdf?src-supplier=Mouser; Supplier 1: Digi-Key; Supplier 2: Newark; Supplier 3: Mouser; Supplier Part Number 1: 13-AC0603FR-101KLDKR-ND; Supplier Part Number 2: 31AK9289; Supplier Part Number 3: 603-AC0603FR-101KL
R11 = RES_47.5K_1%_100mW_0603: SMD Chip Resistor, 47.5 kOhm, ± 1%, 100 mW, 0603 [1608 Metric], Thick Film, General Purpose; Manufacturer: Yageo; Power Rating: 100mW; Voltage Rating: 50V; Temperature Coefficient: 100ppm/°C; Supplier 1: Digikey; Manufacturer Part Number: AC0603FR-0747K5L; RoHS: Yes; Category: Chip SMD Resistors; Stock 1: 18567; Pricing 1: 1=0.1, 10=0.021, 50=0.013, 100=0.0108, 500=0.00734, 1000=0.00633 (USD); Case Code (Imperial): 0603; Case Code (Metric): 1608; Min Operating Temperature: -55°C; Max Operating Temperature: 155°C; Packaging: Tape and Reel; Number of Terminations: 2; Termination: SMD/SMT; Max Power Dissipation: 100mW; Features: Moisture Resistant,Automotive AEC-Q200; Series: AC; Length: 0.063inch; Width: 0.8mm; Height: 0.022inch; Ratings: AEC-Q200; RoHS Compliant: Yes; ComponentLink1URL: http://www.mouser.com/ds/2/447/yageodocoutput-1111992.pdf?src-supplier=Mouser; ComponentLink1Description: http://www.mouser.com/ds/2/447/yageodocoutput-1111992.pdf?src-supplier=Mouser; ComponentLink2URL: https://www.yageo.com/upload/media/product/productsearch/datasheet/rchip/PYu-AC_51_RoHS_L_7.pdf?src-supplier=Digikey; ComponentLink2Description: https://www.yageo.com/upload/media/product/productsearch/datasheet/rchip/PYu-AC_51_RoHS_L_7.pdf?src-supplier=Digikey; ComponentLink3URL: http://www.yageo.com/NewPortal/yageodocoutput?fileName=/pdf/R-Chip/PYu-AC_51_RoHS_L_6.pdf&src-supplier=Digikey; ComponentLink3Description: http://www.yageo.com/NewPortal/yageodocoutput?fileName=/pdf/R-Chip/PYu-AC_51_RoHS_L_6.pdf&src-supplier=Digikey; ComponentLink4URL: http://www.yageo.com/NewPortal/yageodocoutput?fileName=/pdf/R-Chip/PYu-AC_51_RoHS_L_5.pdf&src-supplier=Digikey; ComponentLink4Description: http://www.yageo.com/NewPortal/yageodocoutput?fileName=/pdf/R-Chip/PYu-AC_51_RoHS_L_5.pdf&src-supplier=Digikey; Supplier Part Number 1: YAG5340CT-ND
R12 = RES_100R_1%_100MW_0603: Res Thick Film 0603 100 Ohm 1% 1/10W ±100ppm/°C Molded SMD Punched Carrier T/R; Manufacturer: Panasonic; Power Rating: 100mW; Voltage Rating: 75V; Supplier 1: Mouser; Manufacturer Part Number: ERJ3EKF1000V; RoHS: Yes; Category: Chip SMD Resistors; Stock 1: 2420097; Pricing 1: 1=0.1, 10=0.024, 50=0.024, 100=0.011, 1000=0.008, 10000=0.005 (USD); Mount: Surface Mount; Case/Package: 0603; Contact Plating: Tin; Case Code (Metric): 1608; Weight: 7.1E-05oz; Size Code: 0603; Min Operating Temperature: -55°C; Max Operating Temperature: 155°C; Packaging: Tape and Reel; Package Quantity: 5000; Resistor Type: Thick Film; Termination: SMD/SMT; Temperature Coefficient: 100ppm/°C; Series: ERJ; Number of Terminations: 2; Max Power Dissipation: 100mW; Voltage Rating (DC): 75V; Features: Automotive AEC-Q200; Resistance Tolerance: 1%; Construction: Rectangular; Length: 1.6mm; Width: 0.8mm; Height: 0.45mm; Depth: 0.8mm; Radiation Hardening: No; Reach SVHC Compliant: No; Lead Free: Lead Free; RoHS Compliant: Yes; Military Standard: Not; ComponentLink1URL: https://datasheet.ciiva.com/34303/1987450-34303565.pdf?src-supplier=Jameco; ComponentLink1Description: https://datasheet.ciiva.com/34303/1987450-34303565.pdf?src-supplier=Jameco; ComponentLink2URL: https://datasheet.ciiva.com/24159/aoa0000ce2-24159753.pdf?src-supplier=Mouser; ComponentLink2Description: https://datasheet.ciiva.com/24159/aoa0000ce2-24159753.pdf?src-supplier=Mouser; ComponentLink3URL: https://datasheet.ciiva.com/30088/aoa0000ce2-30088649.pdf?src-supplier=Onlinecomponents.com; ComponentLink3Description: https://datasheet.ciiva.com/30088/aoa0000ce2-30088649.pdf?src-supplier=Onlinecomponents.com; ComponentLink4URL: https://datasheet.ciiva.com/16762/70260748-16762666.pdf?src-supplier=Allied+Electronics; ComponentLink4Description: https://datasheet.ciiva.com/16762/70260748-16762666.pdf?src-supplier=Allied+Electronics; ComponentLink5URL: https://datasheet.ciiva.com/16765/70260748-16765766.pdf?src-supplier=Allied+Electronics; ComponentLink5Description: https://datasheet.ciiva.com/16765/70260748-16765766.pdf?src-supplier=Allied+Electronics; ComponentLink6URL: https://datasheet.ciiva.com/9186/aoa0000ce2-9186725.pdf?src-supplier=Avnet; ComponentLink6Description: https://datasheet.ciiva.com/9186/aoa0000ce2-9186725.pdf?src-supplier=Avnet; ComponentLink7URL: https://datasheet.ciiva.com/48530/aoa0000ce2-48530986.pdf?src-supplier=Avnet; ComponentLink7Description: https://datasheet.ciiva.com/48530/aoa0000ce2-48530986.pdf?src-supplier=Avnet; ComponentLink8URL: https://datasheet.ciiva.com/22667/1678782-22667887.pdf?src-supplier=Element14; ComponentLink8Description: https://datasheet.ciiva.com/22667/1678782-22667887.pdf?src-supplier=Element14; ComponentLink9URL: https://datasheet.ciiva.com/46372/1678782-46372726.pdf?src-supplier=Element14; ComponentLink9Description: https://datasheet.ciiva.com/46372/1678782-46372726.pdf?src-supplier=Element14; ComponentLink10URL: https://datasheet.ciiva.com/46372/1678782-46372727.pdf?src-supplier=Element14; ComponentLink10Description: https://datasheet.ciiva.com/46372/1678782-46372727.pdf?src-supplier=Element14; ComponentLink11URL: https://datasheet.ciiva.com/7830/aoa0000ce2-7830728.pdf?src-supplier=Element14; ComponentLink11Description: https://datasheet.ciiva.com/7830/aoa0000ce2-7830728.pdf?src-supplier=Element14; Supplier Part Number 1: 667-ERJ-3EKF1000V
S1 S2 = SWITCH_NO_SPST_0.05A: Switch Tactile N.O. SPST Round Button Gull Wing 0.05A 12VDC 200000Cycles 2.55N SMD T/R; Manufacturer: ITT C&K; Supplier 1: Digi-Key; Manufacturer Part Number: PTS526SK15SMTR2LFS; RoHS: No; Category: Uncategorized; Stock 1: 382158; Pricing 1: 1=0.12, 10=0.12, 25=0.114, 100=0.1035, 250=0.09732, 500=0.08904, 1000=0.07454 (USD); Supplier Part Number 1: CKN12221-6-ND
U1 = IC_BRIDGE_UART_CP2102N-A02-GQFN28R: Full Speed USB to UART Bridge USB 2.0 3.3V T/R Automotive 28-Pin QFN EP; Manufacturer: Silicon Labs; Operating Supply Current: 9.5mA; Supplier 1: Digikey; Manufacturer Part Number: CP2102N-A02-GQFN28R; RoHS: Yes; Category: USB Interface ICs; Stock 1: 29620; Pricing 1: 1=4.66, 10=4.183, 25=3.954, 100=3.4269, 250=3.2512, 500=2.91728 (USD); Case/Package: QFN; Min Operating Temperature: -40°C; Max Operating Temperature: 85°C; Interface: UART; Series: USBXpress™; Packaging: Cut Tape; ComponentLink1URL: https://www.silabs.com/documents/public/data-sheets/cp2102n-datasheet.pdf?src-supplier=Digikey; ComponentLink1Description: https://www.silabs.com/documents/public/data-sheets/cp2102n-datasheet.pdf?src-supplier=Digikey; ComponentLink2URL: https://4donline.ihs.com/images/VipMasterIC/IC/SILC/SILC-S-A0007770867/SILC-S-A0007770867-1.pdf?hkey=6D3A4C79FDBF58556ACFDE234799DDF0&src-supplier=Farnell; ComponentLink2Description: https://4donline.ihs.com/images/VipMasterIC/IC/SILC/SILC-S-A0007770867/SILC-S-A0007770867-1.pdf?hkey=6D3A4C79FDBF58556ACFDE234799DDF0&src-supplier=Farnell; Supplier Part Number 1: 336-5890-1-ND
U2 = IC_MODULE_ESP32-C3-MINI-1-N4: Multiprotocol Modules SMD module, ESP32-C3FN4, PCB antenna, -40 C +85 C; Manufacturer: Espressif Systems; Supplier 1: Digikey; Manufacturer Part Number: ESP32-C3-MINI-1-N4; RoHS: No; Category: LDO; Stock 1: 26373; Pricing 1: 1=1.8 (USD); ComponentLink1URL: https://datasheet.octopart.com/ESP32-C3-MINI-1-N4-Espressif-Systems-datasheet-165560559.pdf?src-supplier=TME; ComponentLink1Description: https://datasheet.octopart.com/ESP32-C3-MINI-1-N4-Espressif-Systems-datasheet-165560559.pdf?src-supplier=TME; ComponentLink2URL: https://datasheet.octopart.com/ESP32-C3-MINI-1-N4-Espressif-Systems-datasheet-154717747.pdf?src-supplier=SOS+electronic; ComponentLink2Description: https://datasheet.octopart.com/ESP32-C3-MINI-1-N4-Espressif-Systems-datasheet-154717747.pdf?src-supplier=SOS+electronic; Supplier Part Number 1: 1965-ESP32-C3-MINI-1-N4CT-ND